# Altium schematic sheet 05_POWER.SchDoc
size A4
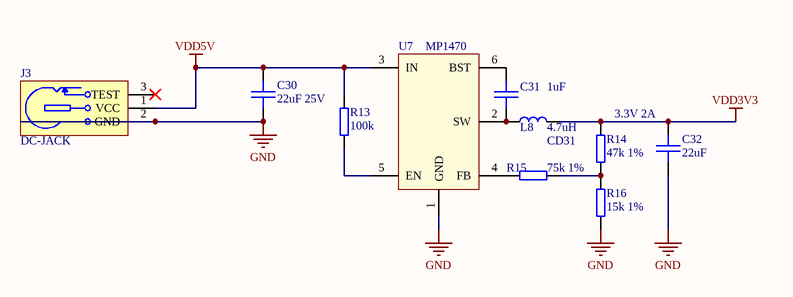
[diagram p0: 05_POWER.SchDoc]

## Parts
C30  22uF 25V  [SMT_C_0805]
C31  1uF  [SMT_C_0402]
C32  22uF  [SMT_C_0805]
J3  DC-JACK  [DC-JACK-6.2mm]
L8  4.7uH  [SMT_L_3.3mm]
R13  100k  [SMT_R_0402]
R14  47k 1%  [SMT_R_0402]
R15  75k 1%  [SMT_R_0402]
R16  15k 1%  [SMT_R_0402]
U7  MP1470  [SOT23-6]

## Nets
GND: C30.2 C32.2 J3.2(GND) R16.2 U7.1(GND)
VDD3V3: C32.1 L8.1 R14.1
VDD5V: C30.1 J3.1(VCC) R13.2 U7.3(IN)
NetC31_1: C31.1 U7.6(BST)
NetC31_2: C31.2 L8.2 U7.2(SW)
NetR13_1: R13.1 U7.5(EN)
NetR14_2: R14.2 R15.1 R16.1
NetR15_2: R15.2 U7.4(FB)

Not connected (* = marked no-connect by the designer): J3 3(TEST)*

## Notes on the sheet
- 3.3V 2A
- (near L8) CD31

## Library data of the parts
C30 C32 = SMT_C_0805: Surface mount capacitor 0805
C31 = SMT_C_0402: Surface mount capacitor 0402
J3 = DC-JACK: 电源插孔
L8 = SMT_L_3.3mm: LPO3310 SMT Power Inductor, 3.3x3.3x1mm
R13-R16 = SMT_R_0402: Surface mount resistor 0402
U7 = MP1470: High-Efficiency, 2A, 16V, 500kHz  Synchronous, Step-Down Converter